# EAGLE design PixiFlood_1.6_PTH (EAGLE 7.2.0)
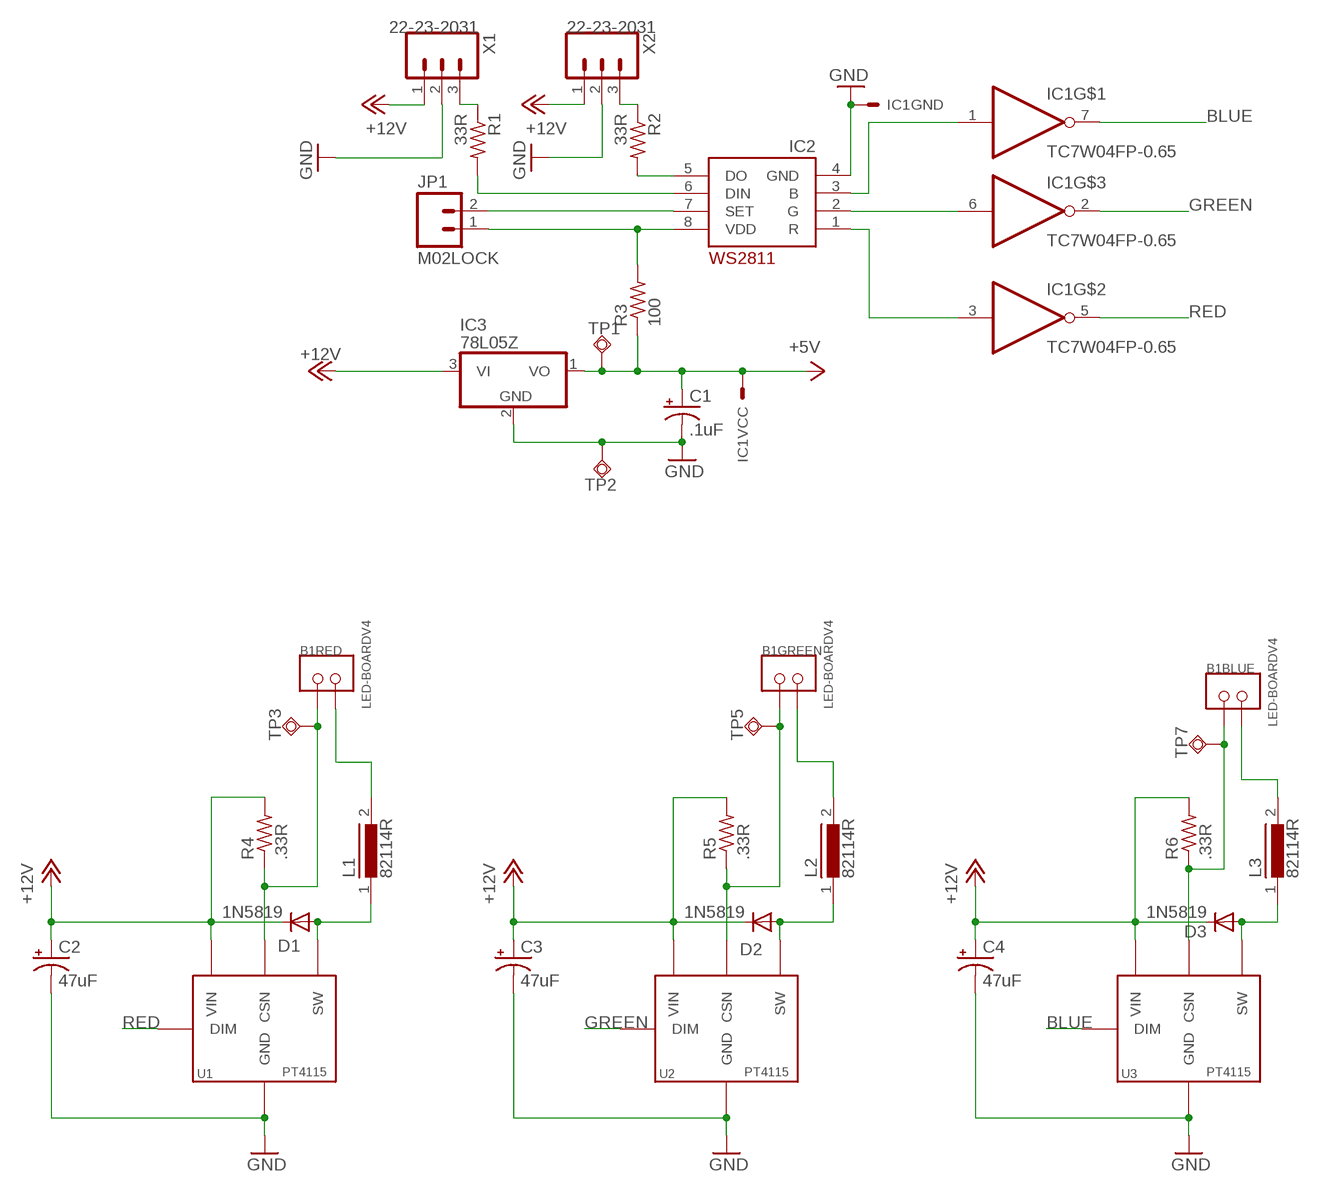
[diagram p0: schematic, sheet 1]

## Parts
B1  LED-BOARDV4  [LED_BOARD-V4]
C1  .1uF  CAP_POLPTH50  [C025X050P]
C2  47uF  CPOL-USE2.5-5  [E2,5-5]
C3  47uF  CPOL-USE2.5-5  [E2,5-5]
C4  47uF  CPOL-USE2.5-5  [E2,5-5]
D1  1N5819  DIODE-DO07  [DO07]
D2  1N5819  DIODE-DO07  [DO07]
D3  1N5819  DIODE-DO07  [DO07]
IC1  TC7W04FP-0.65  [MSOP8]
IC2  WS2811SOP8  [SOP08-P-1.27]
IC3  78L05Z  [TO92]
JP1  M02LOCK  [1X02_LOCK]
L1  82114R  [82114R]
L2  82114R  [82114R]
L3  82114R  [82114R]
R1  33R  R-US_0204/7  [0204/7]
R2  33R  R-US_0204/7  [0204/7]
R3  100  R-US_0204/7  [0204/7]
R4  .33R  R-US_0204/7  [0204/7]
R5  .33R  R-US_0204/7  [0204/7]
R6  .33R  R-US_0204/7  [0204/7]
TP1  TPSQTP20R  [TP20R]
TP2  TPSQTP20SQ  [TP20SQ]
TP3  TPSQTP15R  [TP15R]
TP5  TPSQTP15R  [TP15R]
TP7  TPSQTP15R  [TP15R]
U1  PT4115B89E  [SOT89-5]
U2  PT4115B89E  [SOT89-5]
U3  PT4115B89E  [SOT89-5]
X1  22-23-2031  [22-23-2031]
X2  22-23-2031  [22-23-2031]

## Nets
+5V: C1.1(+) IC1.8(VCC:S) IC3.1(VO) R3.1 TP1.TP
+12V: C2.+ C3.+ C4.+ D1.C D2.C D3.C IC3.3(VI) R4.2 R5.2 R6.2 U1.5(VIN) U2.5(VIN) U3.5(VIN) X1.1 X2.1
BLUE: IC1.7(O) U3.3(DIM)
BOUT: B1.B+ B1.B+@2 R6.1 TP7.TP U3.4(CSN)
GND: C1.2(-) C2.- C3.- C4.- IC1.4(GND:S) IC2.4(GND) IC3.2(GND) TP2.TP U1.2(GND) U1.2A(GND) U1.2A@1(GND) U1.2A@2(GND) U1.2A@3(GND) U1.2A@4(GND) U2.2(GND) U2.2A(GND) U2.2A@1(GND) U2.2A@2(GND) U2.2A@3(GND) U2.2A@4(GND) U3.2(GND) U3.2A(GND) U3.2A@1(GND) U3.2A@2(GND) U3.2A@3(GND) U3.2A@4(GND) X1.2 X2.2
GOUT: B1.G+ B1.G+@1 R5.1 TP5.TP U2.4(CSN)
GREEN: IC1.2(O) U2.3(DIM)
N$1: D1.A L1.1 U1.1(SW)
N$2: D3.A L3.1 U3.1(SW)
N$3: B1.R- B1.R-@1 L1.2
N$4: R2.1 X2.3
N$5: D2.A L2.1 U2.1(SW)
N$6: R1.1 X1.3
N$7: IC2.5(DO) R2.2
N$8: IC2.6(DIN) R1.2
N$9: B1.G- B1.G-@1 L2.2
N$10: B1.B- B1.B-@1 L3.2
N$14: IC2.8(VDD) JP1.1 R3.2
N$15: IC1.3(I) IC2.1(R)
N$16: IC1.1(I) IC2.3(B)
N$17: IC2.7(SET) JP1.2
N$19: IC1.6(I) IC2.2(G)
RED: IC1.5(O) U1.3(DIM)
ROUT: B1.R+ B1.R+@1 R4.1 TP3.TP U1.4(CSN)

## Library data of the parts
B1 = special:LED-BOARD
C1 = capacitors:CAP_POL: Capacitor Polarized These are standard SMD and PTH capacitors. Normally 10uF, 47uF, and 100uF in electrolytic and tantalum varieties. Always verify the external diameter of the through hole cap, it varies with capacity, voltage, and manufacturer. The EIA devices should be standard.
C2-C4 = adafruit:CPOL-US: POLARIZED CAPACITOR, American symbol
D1-D3 = diode:DIODE-: DIODE
IC1 = logic:TC7W04F
IC2 = drivers:WS2811
IC3 = linear:78*: Positive VOLTAGE REGULATOR Source: http://cache.national.com/ds/LM/LM78L05.pdf http://www.fairchildsemi.com/ds/LM/LM7805.pdf
JP1 = SparkFun-Connectors:M02: Standard 2-pin 0.1" header. Use with - straight break away headers ( PRT-00116) - right angle break away headers (PRT-00553) - swiss pins (PRT-00743) - machine pins (PRT-00117) - female headers (PRT-00115) Molex polarized connector foot print use with: PRT-08233 with associated crimp pins and housings. 2.54_SCREWTERM for use with PRT-10571. 3.5mm Screw Terminal footprints for PRT-08084 5mm Screw Terminal footprints for use with PRT-08432
L1-L3 = inductors:82114R: INDUCTOR
R1-R3 = rcl:R-US_: RESISTOR, American symbol
R4-R6 = resistor:R-US_: RESISTOR, American symbol
TP1-TP3 TP5 TP7 = testpad:TPSQ: Test pad
U1-U3 = drivers:PT4115: 30V, 1.2A Step-down High Brightness LED Driver with 5000:1 Dimming PDF: http://www.google.pl/url?sa=t&rct=j&q=PT4115&source=web&cd=1&ved=0CC4QFjAA&url=http%3A%2F%2Fwww.micro-bridge.com%2Fdata%2FCRpowtech%2FPT4115E.pdf&ei=9NbxUKXPJNSzhAem2oGoAQ&usg=AFQjCNEsPWIIWjIVjxpF5YN6SPR3coTTpw&bvm=bv.1357700187,d.d2k
X1 X2 = MyLibrary:22-23-2031: .100" (2.54mm) Center Header - 3 Pin; MF: MOLEX; MPN: 22-23-2031; OC_FARNELL: 1462950; OC_NEWARK: 30C0862

## Board
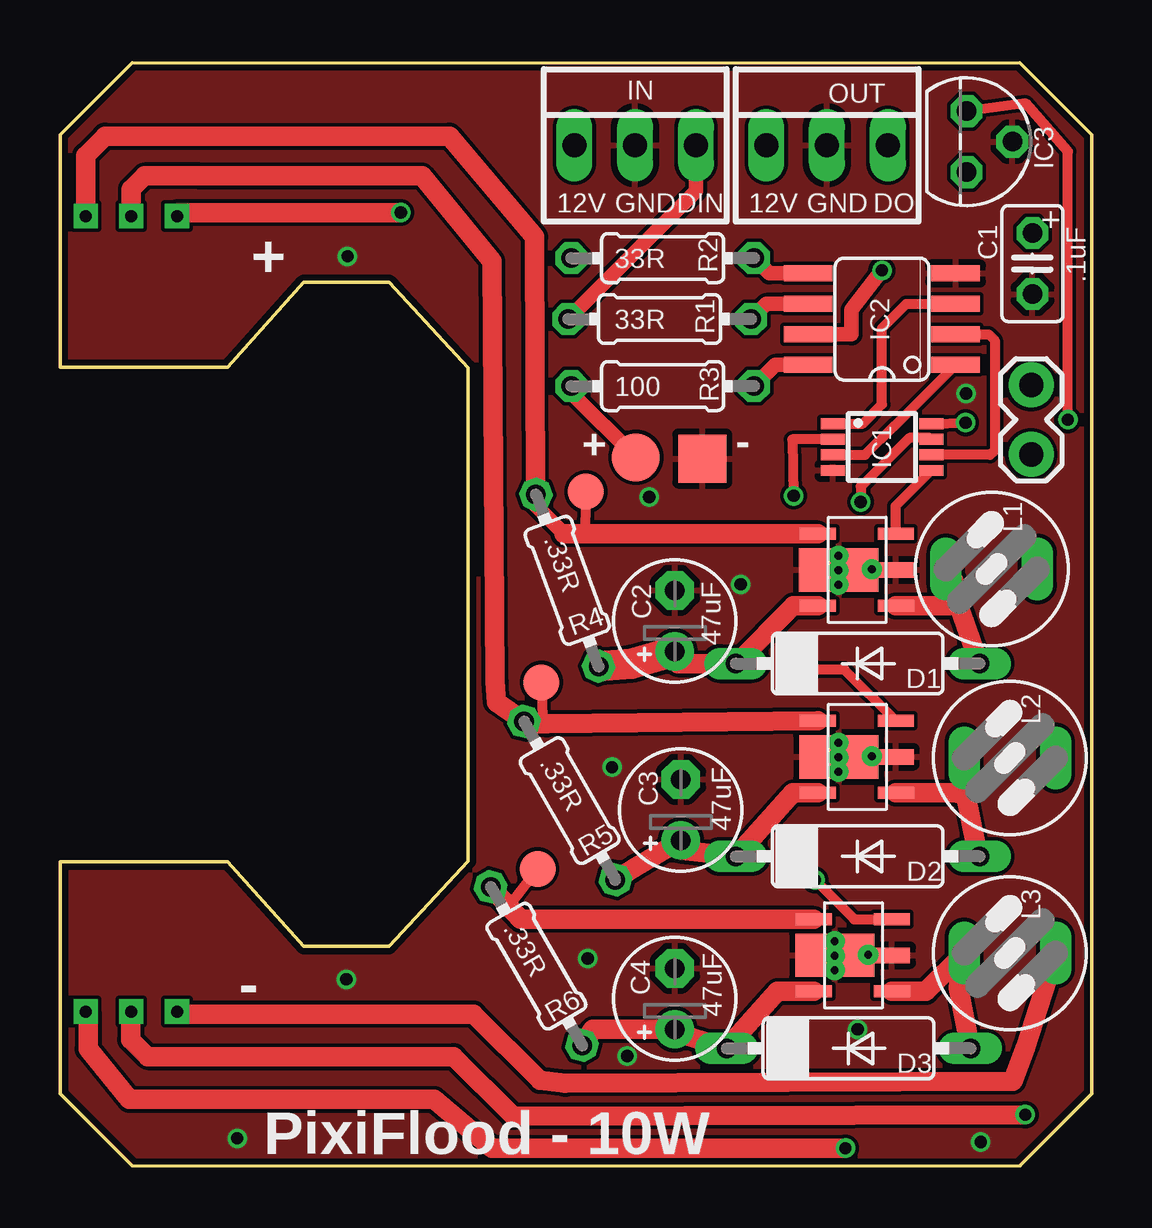
[diagram p1: board, top side]
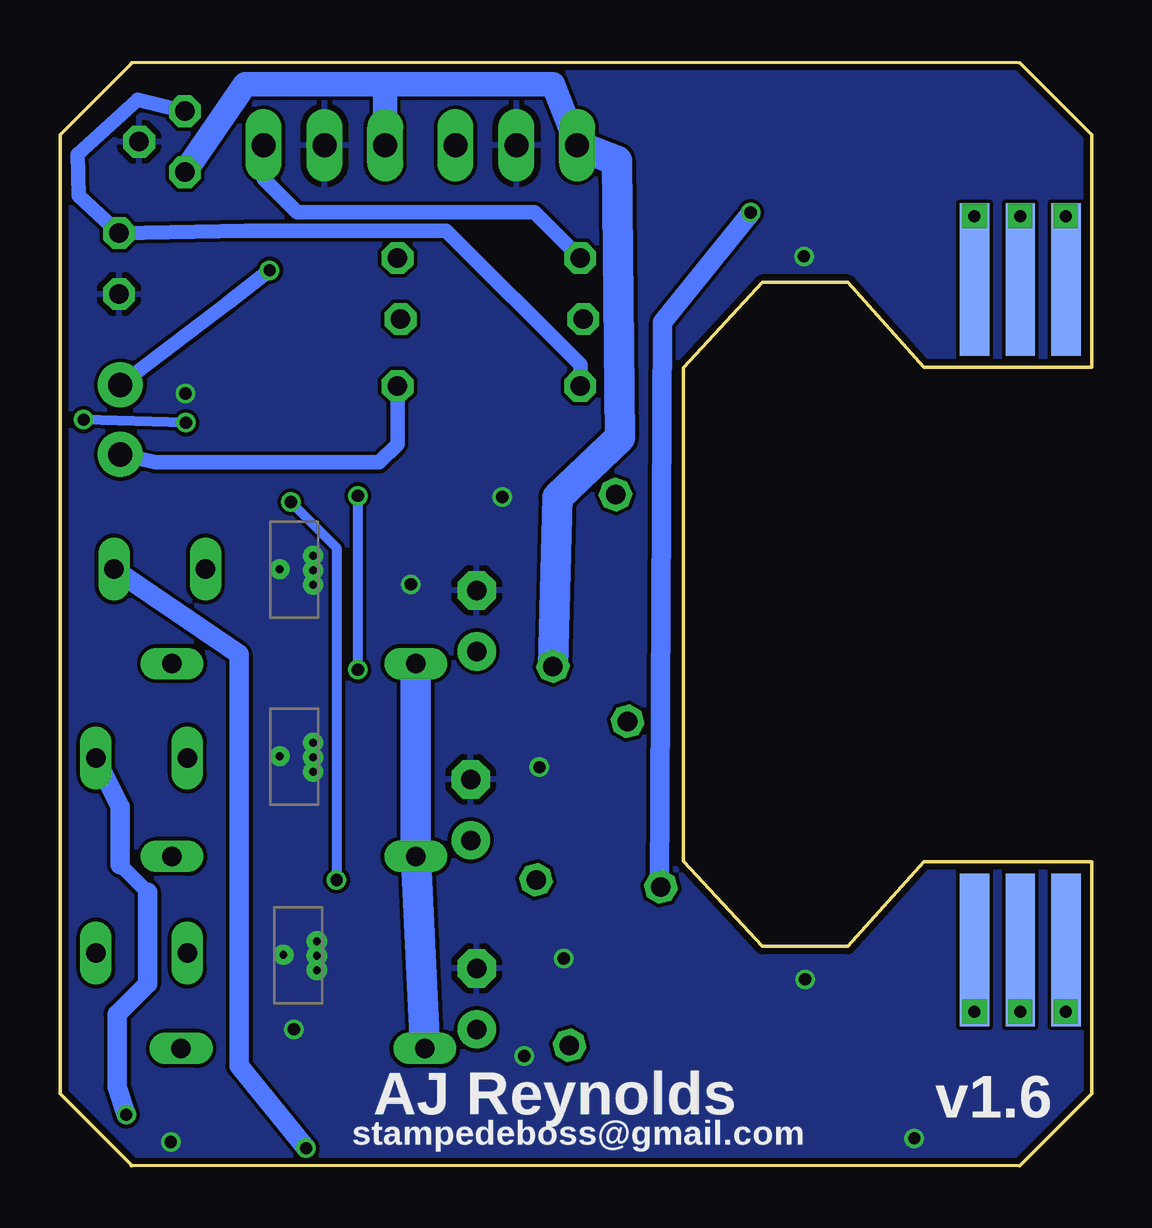
[diagram p2: board, bottom side, seen from below]

Size 43 x 45.96 mm. Coordinates in mm from the lower left corner, seen from the top.
Copper layers (1*16): Top 0.035mm / dielectric 1.5mm / Bottom 0.035mm
Design rules "Elecrow_2-layer_eagle_rule": minimum track width 6mil, minimum drill 12mil, track to track 6mil, track to pad 6mil, pad to pad 6mil, via to via 6mil, smd to smd 0mil, copper to edge 10mil, drill to drill 10mil, minimum pad ring 10mil, minimum via ring 6mil, stop-mask expansion 2mil, vias tented up to drill 100mil, thermal gap 10mil

### Footprints (pad centres in the part's own frame; a part is rotated, then mirrored left to right if it is on the bottom)
LED_BOARD-V4 = smd 1.219 x 6.35 bottom: B+ 4.902,36.957; B- 4.902,9.017; G+ 2.997,36.957; G- 2.997,9.017; R+ 1.092,36.957; R- 1.092,9.017 | drill 0.5 square: B+@2 4.902,39.599; B-@1 4.902,6.452; G+@1 2.997,39.599; G-@1 2.997,6.452; R+@1 1.092,39.599; R-@1 1.092,6.452
C025X050P = drill 0.813 octagon: 1 -1.27,0; 2 1.27,0
E2,5-5 = drill 0.813 pad 1.6: + -1.27,0 | drill 0.813 pad 1.6 octagon: - 1.27,0
DO07 = drill 0.813 long: A 5.08,0; C -5.08,0
MSOP8 = smd 0.45 x 1: 1 -0.975,-2.05; 2 -0.325,-2.05; 3 0.325,-2.05; 4 0.975,-2.05; 5 0.975,2.05; 6 0.325,2.05; 7 -0.325,2.05; 8 -0.975,2.05
SOP08-P-1.27 = smd 0.66 x 2.032: 1 -1.905,-3.073; 2 -0.635,-3.073; 3 0.635,-3.073; 4 1.905,-3.073; 5 1.905,3.073; 6 0.635,3.073; 7 -0.635,3.073; 8 -1.905,3.073
TO92 = drill 0.813 octagon: 1 -1.27,0; 2 0,1.905; 3 1.27,0
1X02_LOCK = drill 1.016 pad 1.88: 1 -0.178,0; 2 2.718,0
82114R = drill 0.813 long: 1 0,1.905; 2 0,-1.905
0204/7 = drill 0.813 octagon: 1 -3.81,0; 2 3.81,0
TP20R = smd 2 x 2: TP 0,0
TP20SQ = smd 2 x 2: TP 0,0
TP15R = smd 1.5 x 1.5: TP 0,0
SOT89-5 = smd 0.5 x 1.5: 1 -1.587,-1.587; 3 1.413,-1.587; 4 1.413,1.663; 5 -1.587,1.663 | smd 0.65 x 1.5: 2 -0.087,-1.587 | smd 1.8 x 3.3: 2A -0.087,0.787 | drill 0.33 pad 0.33: 2A@1 -0.7,0.8; 2A@2 -0.1,0.8; 2A@3 0.5,0.8; 2A@4 -0.059,-0.597
22-23-2031 = drill 1 long: 1 -2.54,0; 2 0,0; 3 2.54,0

### Placement (x,y rotation side)
B1  -0.03,-0.03 0 top
C1  40.54,37.59 270 top
C2  25.63,22.71 90 top
C3  25.88,14.83 90 top
C4  25.63,6.96 90 top
D1  33.25,20.93 0 top
D2  33.25,12.89 0 top
D3  32.87,4.9 0 top
IC1  34.26,29.95 270 top
IC2  34.26,35.28 90 top
IC3  37.8,42.67 270 top
JP1  40.49,29.82 90 top
L1  38.84,24.87 90 top
L2  39.6,16.99 90 top
L3  39.6,8.86 90 top
R1  24.99,35.28 0 top
R2  25.12,37.82 0 top
R3  25.12,32.49 0 top
R4  21.15,24.39 290 top
R5  21.25,15.22 300 top
R6  19.86,8.32 300 top
TP1  24,29.51 0 top
TP2  26.77,29.46 0 top
TP3  21.92,28.09 0 top
TP5  20.07,20.14 0 top
TP7  19.91,12.37 0 top
U1  33.25,24.92 90 top
U2  33.25,17.12 90 top
U3  33.09,8.86 90 top
X1  23.98,42.52 0 top
X2  31.98,42.52 0 top

### Tracks (layer width: path | path; a pad name or v marks a point on that pad's centre or on a via)
+5V  (via drill 0.51)
  Top 0.406: IC1.8 v37.75,30.96 | v42.01,31.09 42.01,42.27 40.26,44.27 IC3.1
  Top 0.61: TP1.TP 21.31,32.21 R3.1
  Bottom 0.406: v37.75,30.96 v42.01,31.09
  Bottom 0.61: R3.1 21.31,33.38 26.9,38.96 35.26,38.96 C1.1 42.21,40.41 42.27,42.14 39.75,44.42 IC3.1
+12V
  Top 0.813: U3.5 29.91,7.27 D3.C 25.79,5.53 C4.+ 22.22,5.69 R6.2 | U2.5 30.56,15.54 D2.C 25.92,13.15 C3.+ | C3.+ 26.04,13.15 | C2.+ 25.76,20.93 D1.C 30.57,23.33 U1.5 | R5.2 23.95,12.42 C3.+
  Top 1.27: R4.2 23.82,20.93 C2.+
  Bottom 1.016: X2.1 29.44,45.06 | 29.44,45.06 22.45,45.06 X1.1 | IC3.3 35.28,45.06 29.44,45.06
  Bottom 1.27: D1.C D2.C 28.17,13.15 D3.C | X1.1 19.79,41.88 19.66,30.33 22.26,27.85 R4.2
BLUE  (via drill 0.51)
  Top 0.406: IC1.7 36.26,30.33 35.41,30.33 33.38,28.3 v33.38,27.66 | v31.47,11.91 33.11,10.27 U3.3
  Bottom 0.406: v33.38,27.66 31.47,25.76 v31.47,11.91
BOUT  (via drill 0.51)
  Top 0.406: TP7.TP 18.85,11.01 19.2,10.27
  Top 0.813: U3.4 19.2,10.27 R6.1 | v14.21,39.72 4.92,39.72 B1.B+@2
  Bottom 0.813: v14.21,39.72 17.88,35.15 18.01,11.53 18.08,11.46 R6.1 | B1.B+ B1.B+@2
GND  (via drill 0.51)
  other vias: 11.99,37.9 7.39,1.14 11.94,7.77 22,8.64 23.01,16.61 28.37,24.23 24.56,27.86 33.25,5.69 38.38,0.99 23.65,4.57 37.77,32.18
  pour Bottom: -0.03,-0.03 43.15,-0.03 43.15,46.96 -0.03,46.96
  pour Top: -0.03,-0.03 43.15,-0.03 43.15,46.96 -0.03,46.96
GOUT
  Top 0.406: TP5.TP 20.12,18.6 20.3,18.42
  Top 0.813: U2.4 20.3,18.42 19.64,18.41 19.6,18.37 R5.1 18.19,19.32 18.14,20.17 18.01,37.69 15.09,41.25 5.82,41.25 3.53,41.25 2.97,40.69 B1.G+@1
  Bottom 0.813: B1.G+ B1.G+@1
GREEN  (via drill 0.51)
  Top 0.406: U2.3 32.7,20.68 v30.58,20.68 | IC1.2 30.53,30.27 v30.58,27.91
  Bottom 0.406: v30.58,20.68 v30.58,27.91
N$1
  Top 0.813: D1.A | D1.A L1.1 arc-90 37.04,23.33 U1.1
N$2
  Top 0.813: D3.A 37.44,7.44 L3.1 36.1,7.27 U3.1
N$3  (via drill 0.51)
  Top 0.61: 1.17,6.43 B1.R-@1
  Top 0.813: v32.74,0.74 18.01,0.74 15.6,2.77 2.9,2.77 1.17,4.88 1.17,6.43
  Bottom 0.813: L1.2 35.53,21.31 35.53,4.17 v32.74,0.74 | B1.R- B1.R-@1
N$4
  Bottom 0.61: X2.3 34.52,41.12 33.12,39.73 23.22,39.73 R2.1
N$5
  Top 0.813: D2.A 38.2,13.27 37.69,15.72 | 37.69,15.72 L2.1 | U2.1 37.38,15.54 arc90 37.69,15.72
N$6
  Top 0.61: X1.3 26.52,40.61 R1.1
N$7
  Top 0.61: IC2.5 29.57,37.19 R2.2
N$8
  Top 0.61: IC2.6 29.44,35.92 R1.2
N$9  (via drill 0.51)
  Top 0.61: 2.95,6.43 B1.G-@1
  Top 0.813: v40.23,2.13 18.9,2.06 16.41,4.55 3.66,4.55 2.95,5.26 2.95,6.43
  Bottom 0.61: 40.49,12.55 39.34,11.4
  Bottom 0.813: L2.2 40.49,14.96 40.49,12.55 | 39.34,11.4 39.34,7.59 40.61,6.32 40.61,3.28 v40.23,2.13 | B1.G- B1.G-@1
N$10
  Top 0.61: 4.93,6.43 B1.B-@1
  Top 0.813: L3.2 40.26,4.95 39.73,3.53 21.06,3.44 20.01,3.56 17.25,6.32 4.98,6.32 B1.B-@1
  Bottom 0.813: B1.B- B1.B-@1
N$14
  Top 0.61: IC2.8 29.82,33.38 R3.2
  Bottom 0.61: JP1.1 39.01,29.31 29.69,29.31 28.93,30.07 R3.2
N$15
  Top 0.406: IC1.3 33.56,29.62 34.77,30.84 34.8,30.84 IC2.1
N$16
  Top 0.406: IC1.1 33.46,30.92 34.26,31.72 34.26,34.9 35.28,35.92 IC2.3
N$17  (via drill 0.51)
  Top 0.61: v34.26,37.31 32.99,35.66 32.99,34.65 IC2.7
  Bottom 0.61: JP1.2 35.99,35.97 v34.26,37.31
N$19
  Top 0.406: IC2.2 38.71,34.65 38.96,34.39 38.96,29.82 38.77,29.62 IC1.6
RED
  Top 0.406: U1.3 34.84,27.49 IC1.5
ROUT
  Top 0.406: TP3.TP 21.89,26.66 21.56,26.33
  Top 0.61: 19.82,27.52 19.72,27.62 R4.1 | 21.01,26.33 19.82,27.52 | 19.82,27.52 19.82,27.91
  Top 0.813: 19.82,27.91 19.79,38.71 16.23,42.9 1.88,42.9 1.07,42.09 B1.R+@1 | U1.4 21.56,26.33 21.01,26.33
  Bottom 0.813: B1.R+ B1.R+@1

### Text on the board
tPlace: IN | OUT | 12V | GND | DIN | 12V | GND | DO | - | + | PixiFlood - 10W
bPlace: v1.6 | AJ Reynolds | stampedeboss@gmail.com